# EAGLE schematic base_circuit (EAGLE 7.5.0)
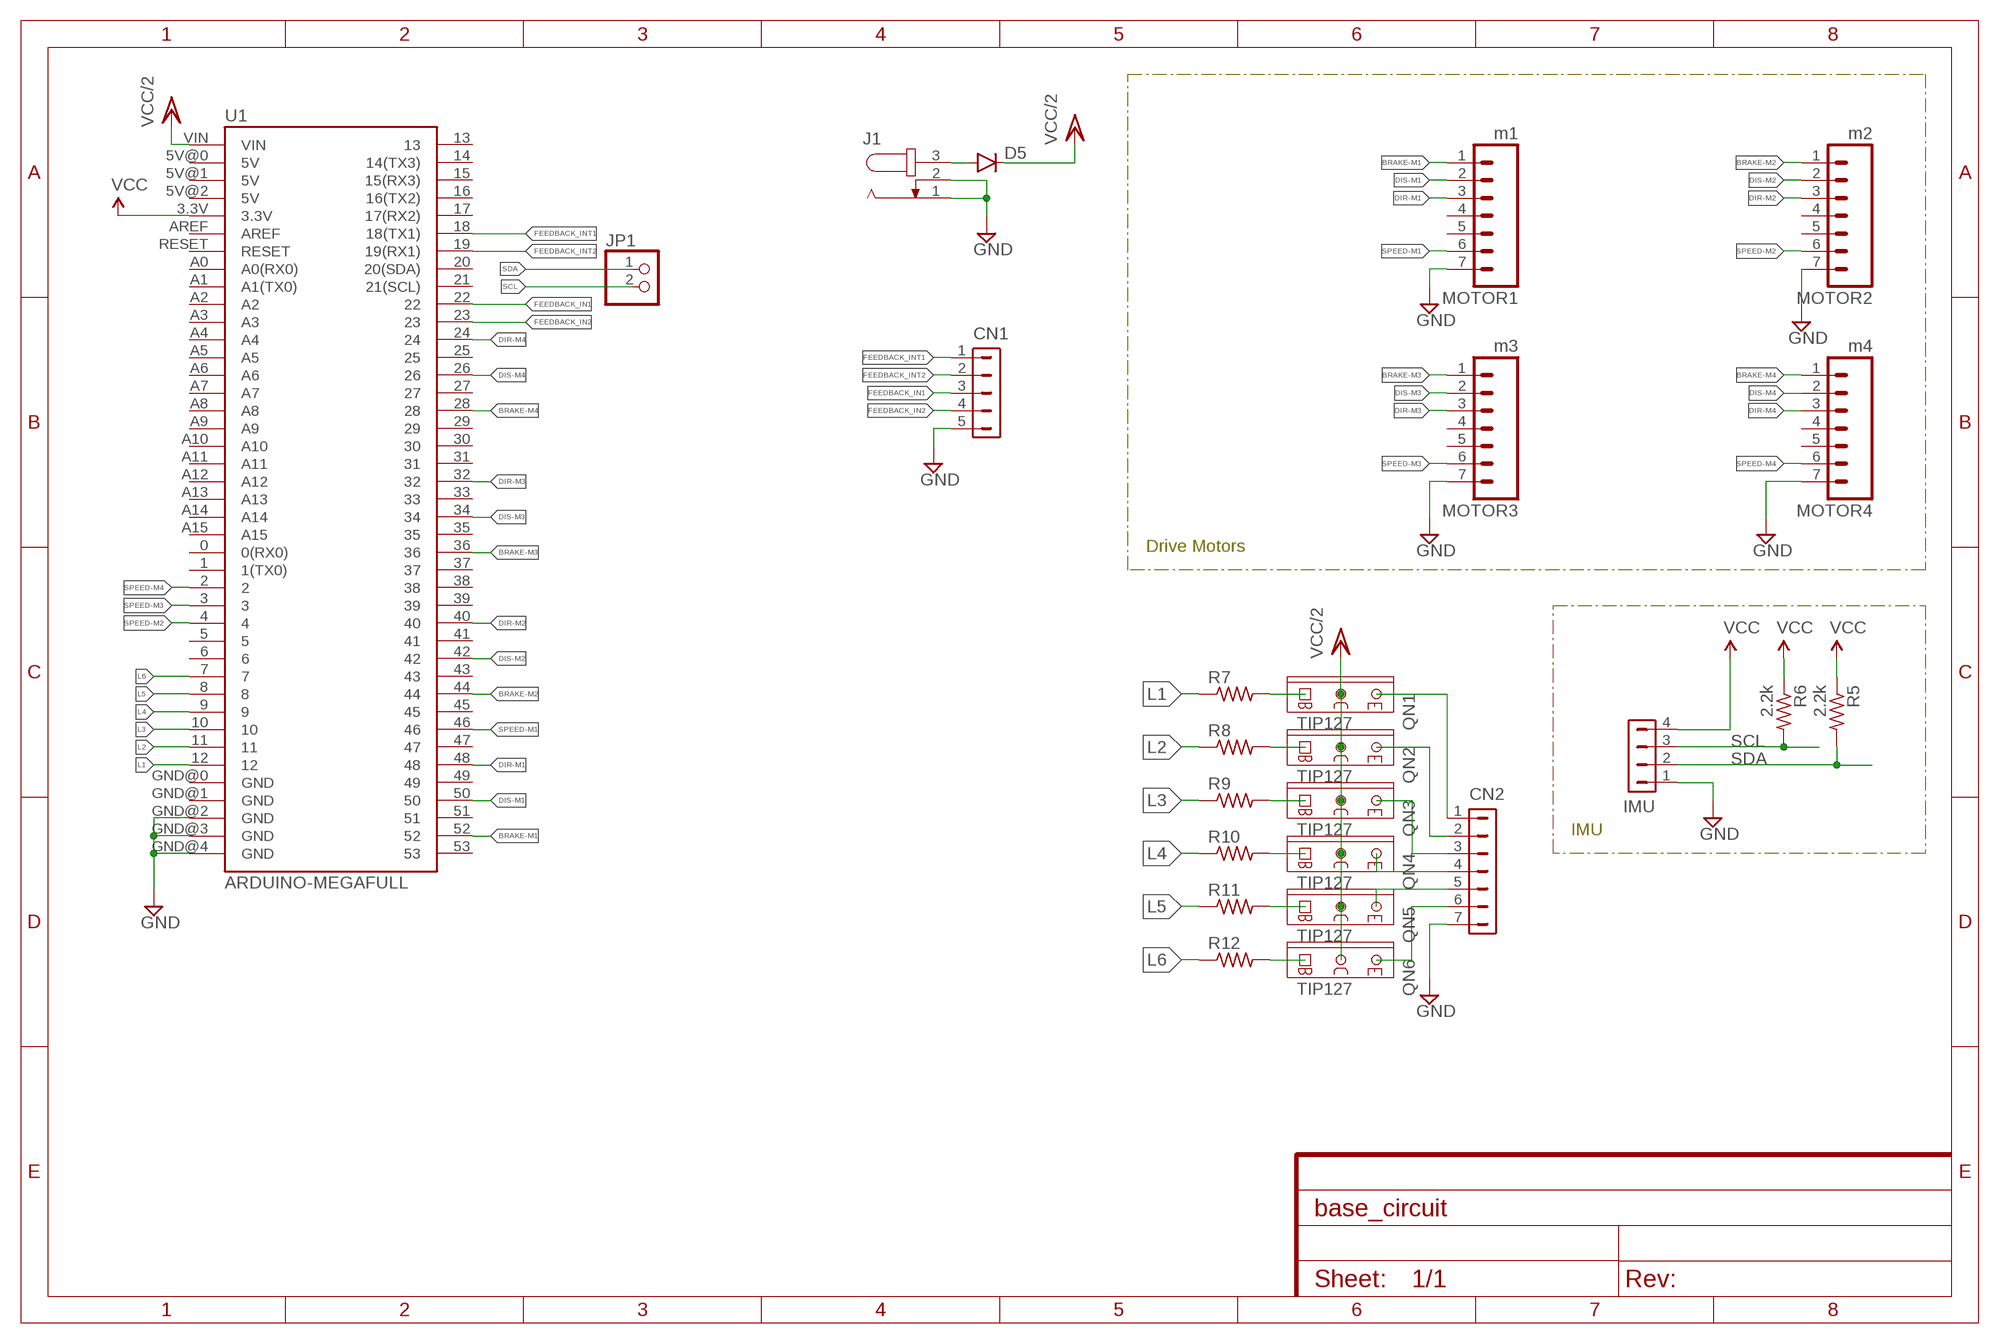
[diagram p0: schematic, sheet 1]

## Parts
CN1  HDR-1X5-MTE-100-L  [MTE-100-5VL]
CN2  HDR-1X7-70543-?  [70543-07]
D5  DIODEPTH  [DIODE-1N4001]
IMU  HDR-1X4-70543-?  [70543-04]
J1  JACK-PLUG1  [SPC4078]
JP1  PINHD-1X2  [1X02]
MOTOR1  m1  M07  [07P]
MOTOR2  m2  M07  [07P]
MOTOR3  m3  M07  [07P]
MOTOR4  m4  M07  [07P]
QN1  TIP127  [TO220AV]
QN2  TIP127  [TO220AV]
QN3  TIP127  [TO220AV]
QN4  TIP127  [TO220AV]
QN5  TIP127  [TO220AV]
QN6  TIP127  [TO220AV]
R5  2.2k  R-US_0204/7  [0204/7]
R6  2.2k  R-US_0204/7  [0204/7]
R7  R-US_0207/10  [0207/10]
R8  R-US_0207/10  [0207/10]
R9  R-US_0207/10  [0207/10]
R10  R-US_0207/10  [0207/10]
R11  R-US_0207/10  [0207/10]
R12  R-US_0207/10  [0207/10]
U1  ARDUINO-MEGAFULL  [ARDUINO_MEGA]

## Nets
BRAKE-M1: MOTOR1.1 U1.52
BRAKE-M2: MOTOR2.1 U1.44
BRAKE-M3: MOTOR3.1 U1.36
BRAKE-M4: MOTOR4.1 U1.28
DIR-M1: MOTOR1.3 U1.48
DIR-M2: MOTOR2.3 U1.40
DIR-M3: MOTOR3.3 U1.32
DIR-M4: MOTOR4.3 U1.24
DIS-M1: MOTOR1.2 U1.50
DIS-M2: MOTOR2.2 U1.42
DIS-M3: MOTOR3.2 U1.34
DIS-M4: MOTOR4.2 U1.26
FEEDBACK_IN1: CN1.3 U1.22
FEEDBACK_IN2: CN1.4 U1.23
FEEDBACK_INT1: CN1.1 U1.18(18(TX1))
FEEDBACK_INT2: CN1.2 U1.19(19(RX1))
GND: CN1.5 CN2.7 IMU.1 J1.1 J1.2 MOTOR1.7 MOTOR2.7 MOTOR3.7 MOTOR4.7 U1.GND@2(GND) U1.GND@3(GND) U1.GND@4(GND)
L1: R7.1 U1.12
L2: R8.1 U1.11
L3: R9.1 U1.10
L4: R10.1 U1.9
L5: R11.1 U1.8
L6: R12.1 U1.7
N$18: QN1.B R7.2
N$19: QN2.B R8.2
N$20: QN3.B R9.2
N$21: QN4.B R10.2
N$22: QN5.B R11.2
N$23: QN6.B R12.2
N$24: D5.A J1.3
N$27: CN2.1 QN1.E
N$28: CN2.2 QN2.E
N$29: CN2.3 QN3.E
N$30: CN2.4 QN4.E
N$31: CN2.5 QN5.E
N$32: CN2.6 QN6.E
SCL: IMU.3 JP1.2 R6.2
SDA: IMU.2 JP1.1 R5.2
SPEED-M1: MOTOR1.6 U1.46
SPEED-M2: MOTOR2.6 U1.4
SPEED-M3: MOTOR3.6 U1.3
SPEED-M4: MOTOR4.6 U1.2
VCC: IMU.4 R5.1 R6.1 U1.3.3V
VCC/2: D5.C QN1.C QN2.C QN3.C QN4.C QN5.C QN6.C U1.VIN
Unconnected: MOTOR1.4 MOTOR1.5 MOTOR2.4 MOTOR2.5 MOTOR3.4 MOTOR3.5 MOTOR4.4 MOTOR4.5 U1.0(0(RX0)) U1.1(1(TX0)) U1.5 U1.5V@0(5V) U1.5V@1(5V) U1.5V@2(5V) U1.6 U1.13 U1.14(14(TX3)) U1.15(15(RX3)) U1.16(16(TX2)) U1.17(17(RX2)) U1.20(20(SDA)) U1.21(21(SCL)) U1.25 U1.27 U1.29 U1.30 U1.31 U1.33 U1.35 U1.37 U1.38 U1.39 U1.41 U1.43 U1.45 U1.47 U1.49 U1.51 U1.53 U1.A0(A0(RX0)) U1.A1(A1(TX0)) U1.A2 U1.A3 U1.A4 U1.A5 U1.A6 U1.A7 U1.A8 U1.A9 U1.A10 U1.A11 U1.A12 U1.A13 U1.A14 U1.A15 U1.AREF U1.GND@0(GND) U1.GND@1(GND) U1.RESET

## Notes on the sheet
- Drive Motors
- IMU

## Library data of the parts
CN1 = con-hdrs40:HDR-1X5: HEADER CONNECTOR
CN2 = con-hdrs40:HDR-1X7: HEADER CONNECTOR
D5 = SparkFun-DiscreteSemi:DIODE: Diode These are standard reverse protection diodes and small signal diodes. SMA package can handle up to about 1A. SOD-323 can handle about 200mA. What the SOD-323 package when ordering, there are some mfgs out there that are 5-pin packages.
IMU = con-hdrs40:HDR-1X4: HEADER CONNECTOR
J1 = con-jack:JACK-PLUG: DC POWER JACK Power Jack, DC, Right Angle, Through Hole, Rated 5A at 16VDC, PC Terminals Distributor: Farnell (www.Farnell.de) Drawing: 84N1161.pdf / 84N1162.pdf Manufacturer: SPC Technology (www.spctechnology.com) Type: SPC4077 / SPC 4078; OC_FARNELL: unknown; OC_NEWARK: unknown
JP1 = pinhead:PINHD-1X2: PIN HEADER
MOTOR1-MOTOR4 = con-amp-quick:M07: AMP QUICK CONNECTOR; OC_FARNELL: unknown; OC_NEWARK: unknown
QN1-QN6 = PAsystem:TIP127: TO-220
R5-R12 = adafruit:R-US_: RESISTOR, American symbol
U1 = SparkFun-Boards:ARDUINO-MEGA: Arduino Mega board footprint

## Net classes
0 default: clearance 0.508 mm
1 vcc24: width 1 mm, clearance 0.406 mm
2 vcc5v: width 0.7 mm, clearance 0.406 mm